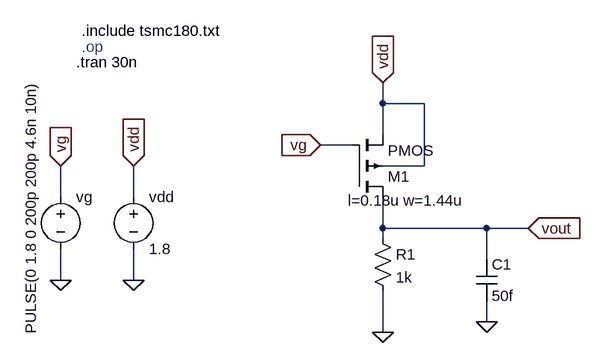
[diagram p0: schematic Strong_1_weak_0_pmos.asc]
Strong_1_weak_0_pmos.asc, the LTspice schematic file:
Version 4
SHEET 1 880 680
WIRE -272 112 -272 80
WIRE -208 112 -272 112
WIRE -272 160 -272 112
WIRE -320 176 -368 176
WIRE -208 208 -208 112
WIRE -208 208 -272 208
WIRE -768 256 -768 208
WIRE -656 256 -656 208
WIRE -272 304 -272 256
WIRE -112 304 -272 304
WIRE -48 304 -112 304
WIRE -272 320 -272 304
WIRE -112 352 -112 304
WIRE -768 384 -768 336
WIRE -656 384 -656 336
WIRE -112 448 -112 416
WIRE -272 464 -272 400
FLAG -768 384 0
FLAG -768 208 vg
IOPIN -768 208 In
FLAG -656 384 0
FLAG -656 208 vdd
IOPIN -656 208 In
FLAG -272 80 vdd
IOPIN -272 80 In
FLAG -368 176 vg
IOPIN -368 176 In
FLAG -272 464 0
FLAG -112 448 0
FLAG -48 304 vout
IOPIN -48 304 In
SYMBOL voltage -768 240 R0
WINDOW 123 0 0 Left 0
WINDOW 39 0 0 Left 0
WINDOW 3 -46 -164 VRight 2
SYMATTR Value PULSE(0 1.8 0 200p 200p 4.6n 10n)
SYMATTR InstName vg
SYMBOL voltage -656 240 R0
WINDOW 123 0 0 Left 0
WINDOW 39 0 0 Left 0
SYMATTR InstName vdd
SYMATTR Value 1.8
SYMBOL pmos4 -320 256 M180
WINDOW 123 -6 -5 Left 2
SYMATTR Value2 l=0.18u w=1.44u
SYMATTR InstName M1
SYMBOL res -288 304 R0
SYMATTR InstName R1
SYMATTR Value 1k
SYMBOL cap -128 352 R0
SYMATTR InstName C1
SYMATTR Value 50f
TEXT -736 24 Left 2 ;.op
TEXT -736 0 Left 2 !.include tsmc180.txt
TEXT -744 48 Left 2 !.tran 30n

The netlist it stands for:
* Strong_1_weak_0_pmos.asc
vg vg 0 PULSE(0 1.8 0 200p 200p 4.6n 10n)
vdd vdd 0 1.8
M1 vout vg vdd vdd PMOS l=0.18u w=1.44u
R1 vout 0 1k
C1 vout 0 50f
.model NMOS NMOS
.model PMOS PMOS
.lib standard.mos
* .op
.include tsmc180.txt
.tran 30n
.backanno
.end